# Altium project etna-main.PrjPcb
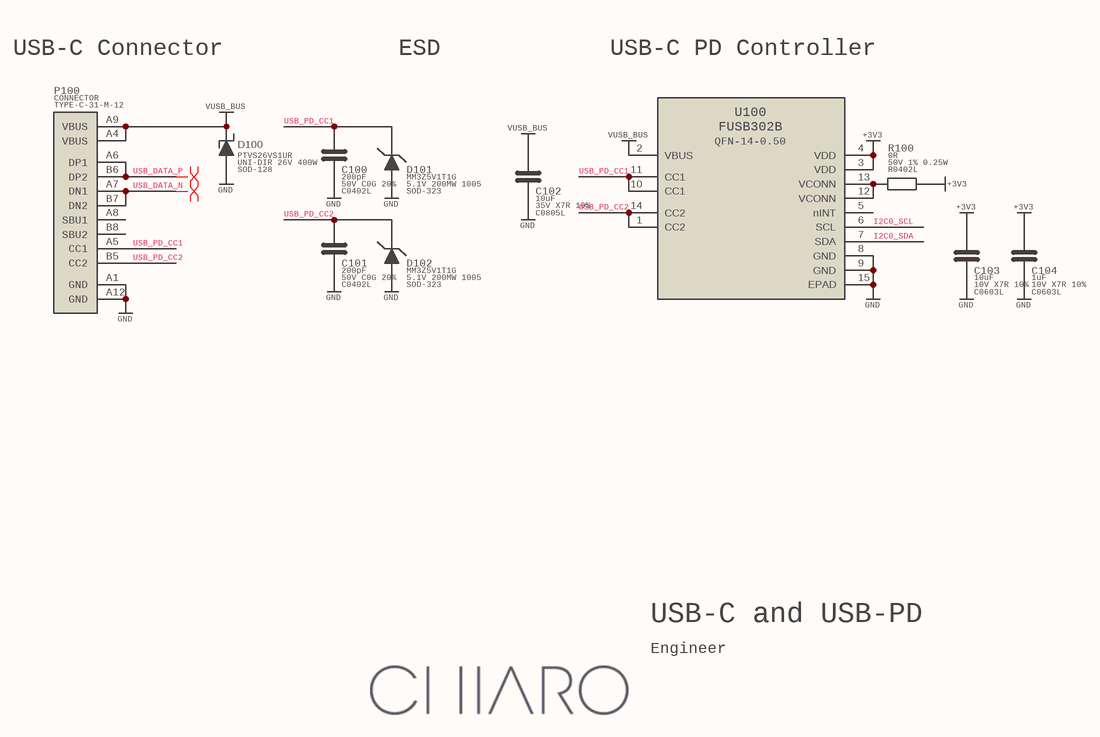
[diagram p0: etna-main-usb.SchDoc]
name: Dominic Moffat; partname: Mainboard; partnumber: 000000; project: ETNA; version: 2.0.0
5 sheets, 104 parts. Net scope: global (net labels, ports and power ports of the same name join across sheets).
Board files: etna-main-panel.PcbDoc, etna-main-pcb.PcbDoc
Sheets:
  etna-main-usb.SchDoc
  etna-main-pmic.SchDoc
  etna-main-mcu.SchDoc
  etna-main-ui.SchDoc
  etna-main-driver.SchDoc

## Sheet etna-main-usb.SchDoc
size A4; DocumentNumber: 1; SheetNumber: 1; SheetTotal: 5; PageSetup: Record=PageOptions|CenterHorizontal=True|CenterVertical=True|PrintScale=0.73|XCorrection=1.00|YCorrection=1.00|PrintKind=1|BorderSize=5000000|LeftOffset=0|BottomOffset=0|Orientation=2|PaperLength=1000|PaperWidth=1000|Scale=100|PaperSource=15|PrintQuality=1200|MediaType=1|DitherType=10|PaperKind=A4|PrintScaleMode=1

### Parts
C100  value 200pF  Specification: 50V C0G 20%  [C0402L]
C101  value 200pF  Specification: 50V C0G 20%  [C0402L]
C102  value 10uF  Specification: 35V X7R 10%  [C0805L]  (hidden comment: 100n)
C103  value 10uF  Specification: 10V X7R 10%  [C0603L]  (hidden comment: 100n)
C104  value 1uF  Specification: 10V X7R 10%  [C0603L]  (hidden comment: 100n)
D100  value PTVS26VS1UR  Specification: UNI-DIR 26V 400W  [SOD-128]  (hidden comment: DIODE_ZEN)
D101  value MM3Z5V1T1G  Specification: 5.1V 200MW 1005  [SOD-323]  (hidden comment: DIODE_TVS)
D102  value MM3Z5V1T1G  Specification: 5.1V 200MW 1005  [SOD-323]  (hidden comment: DIODE_TVS)
P100  value CONNECTOR  [TYPE-C-31-M-12]  (hidden comment: TYPE-C-31-M-12)
R100  value 0R  Specification: 50V 1% 0.25W  [R0402L]
U100  FUSB302B  [QFN-14-0.50]

### Nets
+3V3: C103.1 C104.1 R100.1 U100.3(VDD) U100.4(VDD)
GND: C100.2 C101.2 C102.2 C103.2 C104.2 D100.1(A) D101.1(A) D102.1(A) P100.A1(GND) P100.A12(GND) U100.8(GND) U100.9(GND) U100.15(EPAD)
VUSB_BUS: C102.1 D100.2(K) P100.A4(VBUS) P100.A9(VBUS) U100.2(VBUS)
I2C0_SCL: U100.6(SCL)
I2C0_SDA: U100.7(SDA)
USB_DATA_N: P100.A7(DN1) P100.B7(DN2)
USB_DATA_P: P100.A6(DP1) P100.B6(DP2)
USB_PD_CC1: C100.1 D101.2(K) P100.A5(CC1) U100.10(CC1) U100.11(CC1)
USB_PD_CC2: C101.1 D102.2(K) P100.B5(CC2) U100.1(CC2) U100.14(CC2)
NetR100_2: R100.2 U100.12(VCONN) U100.13(VCONN)

Not connected (* = marked no-connect by the designer): P100 A8(SBU1) B8(SBU2); U100 5(nINT) 44(N.C.)

### Layout directives
differential pair: USB_DATA_N, USB_DATA_P

### Notes on the sheet
- USB-C Connector
- ESD
- USB-C PD Controller
- USB-C and USB-PD
- Engineer

### Library data of the parts
C100-C104 = CAPACITOR_NONPOL
R100 = RESISTOR
U100 = FUSB302B: Value: FUSB302B

## Sheet etna-main-pmic.SchDoc
size A4; DocumentNumber: 1; SheetNumber: 2; SheetTotal: 5; PageSetup: Record=PageOptions|CenterHorizontal=True|CenterVertical=True|PrintScale=0.73|XCorrection=1.00|YCorrection=1.00|PrintKind=1|BorderSize=5000000|LeftOffset=0|BottomOffset=0|Orientation=2|PaperLength=1000|PaperWidth=1000|Scale=100|PaperSource=15|PrintQuality=1200|MediaType=1|DitherType=10|PaperKind=A4|PrintScaleMode=1
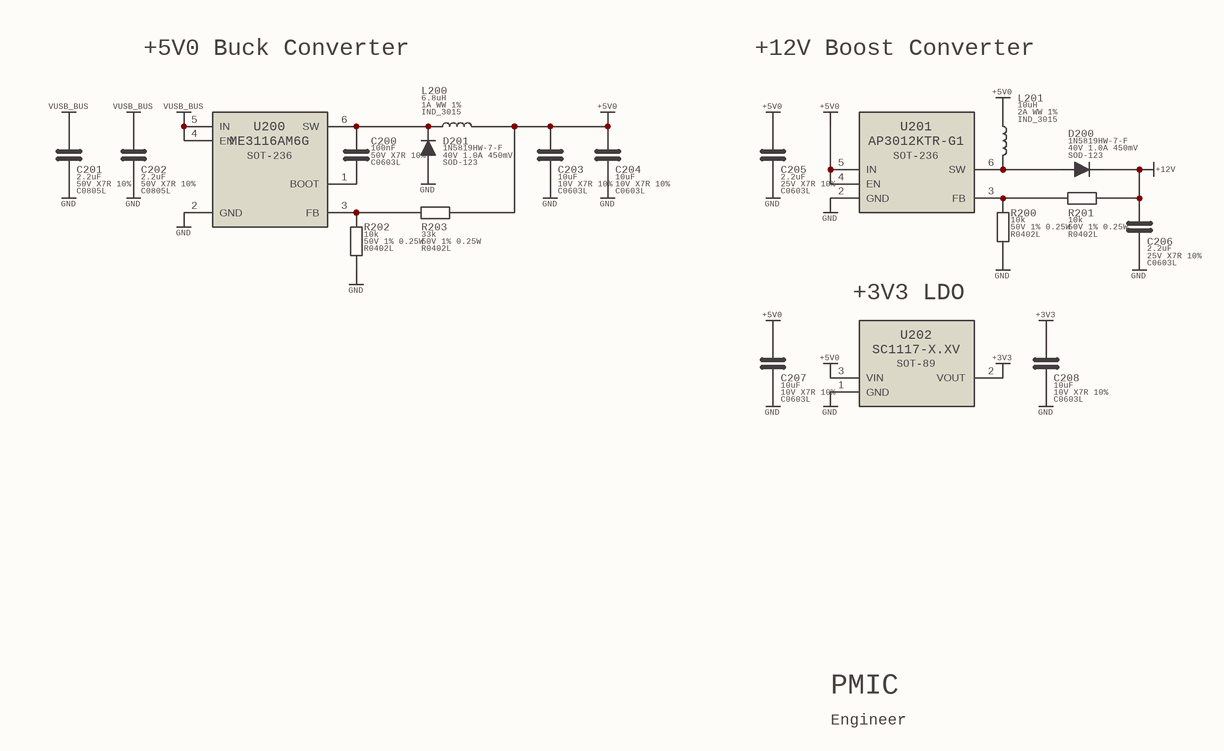
[diagram p1: etna-main-pmic.SchDoc]

### Parts
C200  value 100nF  Specification: 50V X7R 10%  [C0603L]  (hidden comment: 100n)
C201  value 2.2uF  Specification: 50V X7R 10%  [C0805L]  (hidden comment: 100n)
C202  value 2.2uF  Specification: 50V X7R 10%  [C0805L]  (hidden comment: 100n)
C203  value 10uF  Specification: 10V X7R 10%  [C0603L]  (hidden comment: 100n)
C204  value 10uF  Specification: 10V X7R 10%  [C0603L]  (hidden comment: 100n)
C205  value 2.2uF  Specification: 25V X7R 10%  [C0603L]  (hidden comment: 100n)
C206  value 2.2uF  Specification: 25V X7R 10%  [C0603L]  (hidden comment: 100n)
C207  value 10uF  Specification: 10V X7R 10%  [C0603L]  (hidden comment: 100n)
C208  value 10uF  Specification: 10V X7R 10%  [C0603L]  (hidden comment: 100n)
D200  value 1N5819HW-7-F  Specification: 40V 1.0A 450mV  [SOD-123]  (hidden comment: DIODE)
D201  value 1N5819HW-7-F  Specification: 40V 1.0A 450mV  [SOD-123]  (hidden comment: DIODE)
L200  value 6.8uH  Specification: 1A WW 1%  [IND_3015]  (hidden comment: INDUCTOR)
L201  value 10uH  Specification: 2A WW 1%  [IND_3015]  (hidden comment: INDUCTOR)
R200  value 10k  Specification: 50V 1% 0.25W  [R0402L]
R201  value 10k  Specification: 50V 1% 0.25W  [R0402L]
R202  value 10k  Specification: 50V 1% 0.25W  [R0402L]
R203  value 33k  Specification: 50V 1% 0.25W  [R0402L]
U200  ME3116AM6G  [SOT-236]
U201  AP3012KTR-G1  [SOT-236]
U202  SC1117-X.XV  [SOT-89]

### Nets
+3V3: C208.1 U202.2(VOUT)
+5V0: C203.1 C204.1 C205.1 C207.1 L200.2 L201.1 R203.1 U201.4(EN) U201.5(IN) U202.3(VIN)
+12V: C206.1 D200.2(K) R201.2
GND: C201.2 C202.2 C203.2 C204.2 C205.2 C206.2 C207.2 C208.2 D201.1(A) R200.2 R202.2 U200.2(GND) U201.2(GND) U202.1(GND)
VUSB_BUS: C201.1 C202.1 U200.4(EN) U200.5(IN)
NetC200_1: C200.1 D201.2(K) L200.1 U200.6(SW)
NetC200_2: C200.2 U200.1(BOOT)
NetD200_1: D200.1(A) L201.2 U201.6(SW)
NetR200_1: R200.1 R201.1 U201.3(FB)
NetR202_1: R202.1 R203.2 U200.3(FB)

Not connected (* = marked no-connect by the designer): U200 44(N.C.); U201 44(N.C.); U202 44(N.C.)

### Notes on the sheet
- +5V0 Buck Converter
- +12V Boost Converter
- +3V3 LDO
- PMIC
- Engineer

### Library data of the parts
C200-C208 = CAPACITOR_NONPOL
R200-R203 = RESISTOR
U200 = LMR14006: Value: ME3116AM6G
U201 = AP3012KTR-G1: Value: AP3012KTR-G1
U202 = SC1117-X.XV: Value: SC1117-X.XV

## Sheet etna-main-mcu.SchDoc
size A4; DocumentNumber: 1; SheetNumber: 3; SheetTotal: 5; PageSetup: Record=PageOptions|CenterHorizontal=True|CenterVertical=True|PrintScale=0.73|XCorrection=1.00|YCorrection=1.00|PrintKind=1|BorderSize=5000000|LeftOffset=0|BottomOffset=0|Orientation=2|PaperLength=1000|PaperWidth=1000|Scale=100|PaperSource=15|PrintQuality=1200|MediaType=1|DitherType=10|PaperKind=A4|PrintScaleMode=1
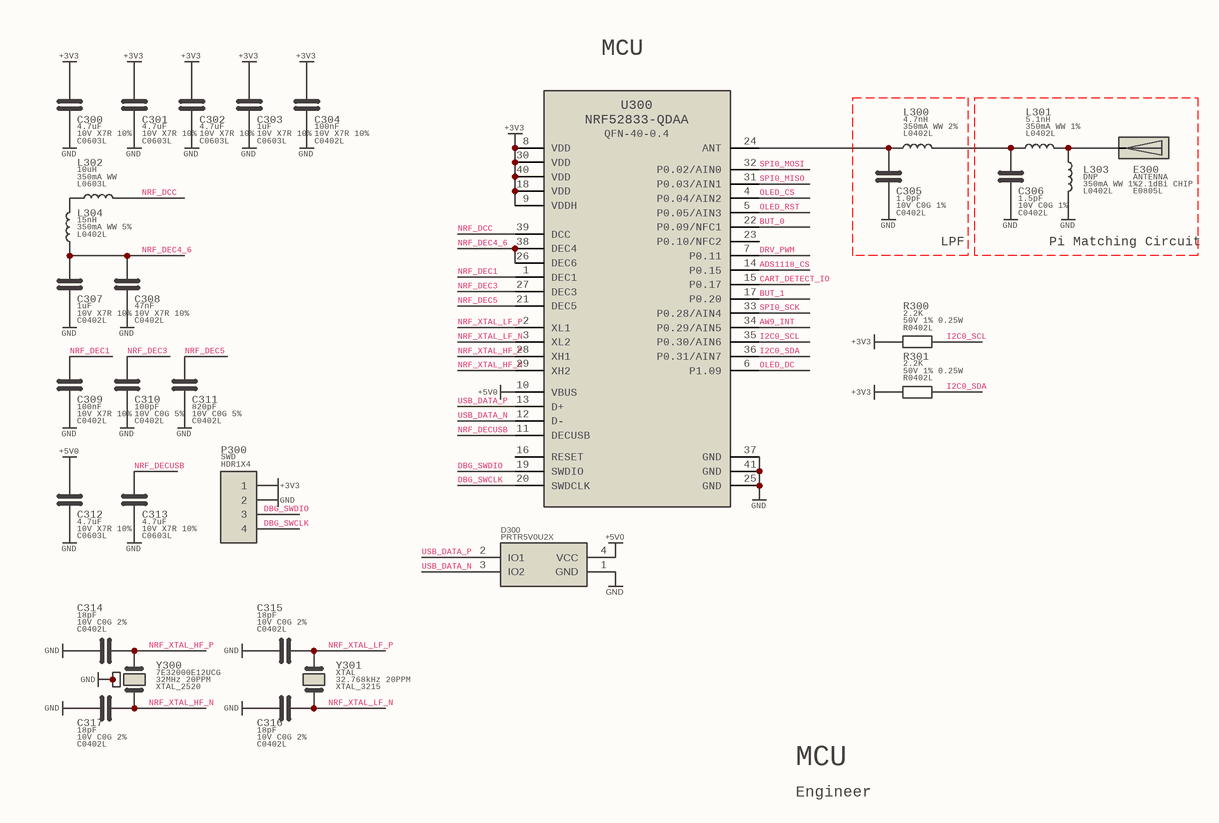
[diagram p2: etna-main-mcu.SchDoc]

### Parts
C300  value 4.7uF  Specification: 10V X7R 10%  [C0603L]
C301  value 4.7uF  Specification: 10V X7R 10%  [C0603L]
C302  value 4.7uF  Specification: 10V X7R 10%  [C0603L]
C303  value 1uF  Specification: 10V X7R 10%  [C0603L]
C304  value 100nF  Specification: 10V X7R 10%  [C0402L]
C305  value 1.0pF  Specification: 10V C0G 1%  [C0402L]
C306  value 1.5pF  Specification: 10V C0G 1%  [C0402L]
C307  value 1uF  Specification: 10V X7R 10%  [C0402L]
C308  value 47nF  Specification: 10V X7R 10%  [C0402L]
C309  value 100nF  Specification: 10V X7R 10%  [C0402L]
C310  value 100pF  Specification: 10V C0G 5%  [C0402L]
C311  value 820pF  Specification: 10V C0G 5%  [C0402L]
C312  value 4.7uF  Specification: 10V X7R 10%  [C0603L]
C313  value 4.7uF  Specification: 10V X7R 10%  [C0603L]
C314  value 18pF  Specification: 10V C0G 2%  [C0402L]
C315  value 18pF  Specification: 10V C0G 2%  [C0402L]
C316  value 18pF  Specification: 10V C0G 2%  [C0402L]
C317  value 18pF  Specification: 10V C0G 2%  [C0402L]
D300  PRTR5V0U2X  [SOT-143B]
E300  Specification: -2.1dBi CHIP  [E0805L]  (hidden comment: ANTENNA)
L300  value 4.7nH  Specification: 350mA WW 2%  [L0402L]  (hidden comment: INDUCTOR)
L301  value 5.1nH  Specification: 350mA WW 1%  [L0402L]  (hidden comment: INDUCTOR)
L302  value 10uH  Specification: 350mA WW  [L0603L]  (hidden comment: INDUCTOR)
L303  value DNP  Specification: 350mA WW 1%  [L0402L]  (hidden comment: INDUCTOR)
L304  value 15nH  Specification: 350mA WW 5%  [L0402L]  (hidden comment: INDUCTOR)
P300  value SWD  [HDR1X4]  (hidden comment: H4)
R300  value 2.2K  Specification: 50V 1% 0.25W  [R0402L]
R301  value 2.2K  Specification: 50V 1% 0.25W  [R0402L]
U300  NRF52833-QDAA  [QFN-40-0.4]
Y300  value 7E32000E12UCG  Specification: 32MHz 20PPM  [XTAL_2520]  (hidden comment: XTAL_4P)
Y301  value XTAL  Specification: 32.768kHz 20PPM  [XTAL_3215]  (hidden comment: XTAL_2P)

### Nets
+3V3: C300.1 C301.1 C302.1 C303.1 C304.1 P300.1 R300.1 R301.1 U300.8(VDD) U300.9(VDDH) U300.18(VDD) U300.30(VDD) U300.40(VDD)
+5V0: C312.1 D300.4(VCC) U300.10(VBUS)
GND: C300.2 C301.2 C302.2 C303.2 C304.2 C305.2 C306.2 C307.2 C308.2 C309.2 C310.2 C311.2 C312.2 C313.2 C314.1 C315.1 C316.1 C317.1 D300.1(GND) L303.2 P300.2 U300.25(GND) U300.37(GND) U300.41(GND) Y300.2(GND) Y300.4(GND)
ADS1118_CS: U300.14(P0.15)
AW9_INT: U300.34(P0.29/AIN5)
BUT_0: U300.22(P0.09/NFC1)
BUT_1: U300.17(P0.20)
CART_DETECT_IO: U300.15(P0.17)
DBG_SWCLK: P300.4 U300.20(SWDCLK)
DBG_SWDIO: P300.3 U300.19(SWDIO)
DRV_PWM: U300.7(P0.11)
I2C0_SCL: R300.2 U300.35(P0.30/AIN6)
I2C0_SDA: R301.2 U300.36(P0.31/AIN7)
NRF_DCC: L302.2 U300.39(DCC)
NRF_DEC1: C309.1 U300.1(DEC1)
NRF_DEC3: C310.1 U300.27(DEC3)
NRF_DEC4_6: C307.1 C308.1 L304.1 U300.26(DEC6) U300.38(DEC4)
NRF_DEC5: C311.1 U300.21(DEC5)
NRF_DECUSB: C313.1 U300.11(DECUSB)
NRF_XTAL_HF_N: C317.2 U300.29(XH2) Y300.3(OSC2)
NRF_XTAL_HF_P: C314.2 U300.28(XH1) Y300.1(OSC1)
NRF_XTAL_LF_N: C316.2 U300.3(XL2) Y301.2(OSC2)
NRF_XTAL_LF_P: C315.2 U300.2(XL1) Y301.1(OSC1)
OLED_CS: U300.4(P0.04/AIN2)
OLED_DC: U300.6(P1.09)
OLED_RST: U300.5(P0.05/AIN3)
SPI0_MISO: U300.31(P0.03/AIN1)
SPI0_MOSI: U300.32(P0.02/AIN0)
SPI0_SCK: U300.33(P0.28/AIN4)
USB_DATA_N: D300.3(IO2) U300.12(D-)
USB_DATA_P: D300.2(IO1) U300.13(D+)
NetC305_1: C305.1 L300.1 U300.24(ANT)
NetC306_1: C306.1 L300.2 L301.1
NetE300_1: E300.1(IN) L301.2 L303.1
NetL302_1: L302.1 L304.2

Not connected (* = marked no-connect by the designer): U300 16(RESET) 23(P0.10/NFC2) 44(N.C.)

### Notes on the sheet
- MCU
- LPF
- (near L303) Pi Matching Circuit
- Engineer

### Library data of the parts
C300-C317 = CAPACITOR_NONPOL
D300 = PRTR5V0U2X: Ultra low capacitance double rail-to-rail ESD protection diode
R300 R301 = RESISTOR
U300 = NRF52833-QDAA: RF System on a Chip - SoC nRF52833-QIAA QFN 40L 5x5; Value: NRF52833-QDAA
E300 = ANTENNA: Value: ANTENNA

## Sheet etna-main-ui.SchDoc
size A4; DocumentNumber: 1; SheetNumber: 4; SheetTotal: 5; PageSetup: Record=PageOptions|CenterHorizontal=True|CenterVertical=True|PrintScale=0.73|XCorrection=1.00|YCorrection=1.00|PrintKind=1|BorderSize=5000000|LeftOffset=0|BottomOffset=0|Orientation=2|PaperLength=1000|PaperWidth=1000|Scale=100|PaperSource=15|PrintQuality=1200|MediaType=1|DitherType=10|PaperKind=A4|PrintScaleMode=1
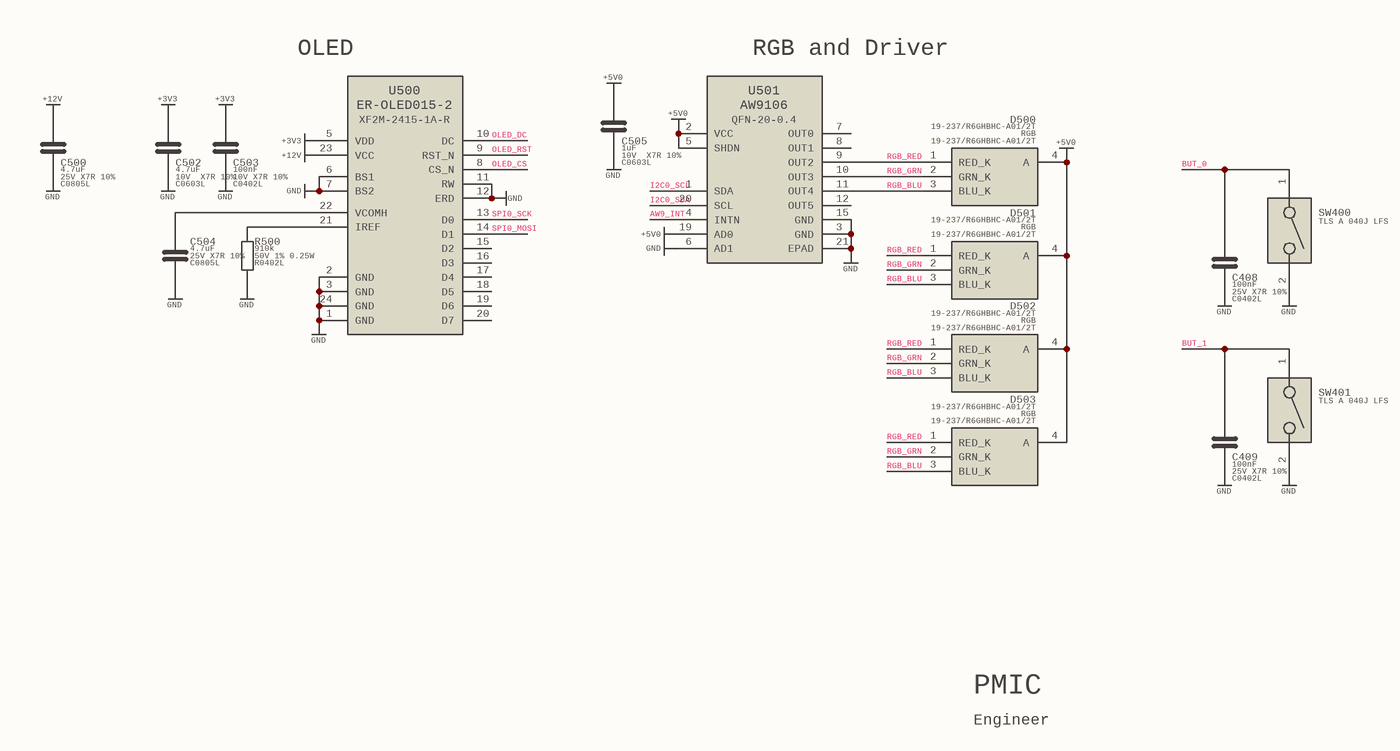
[diagram p3: etna-main-ui.SchDoc]

### Parts
C408  value 100nF  Specification: 25V X7R 10%  [C0402L]
C409  value 100nF  Specification: 25V X7R 10%  [C0402L]
C500  value 4.7uF  Specification: 25V X7R 10%  [C0805L]
C502  value 4.7uF  Specification: 10V  X7R 10%  [C0603L]
C503  value 100nF  Specification: 10V X7R 10%  [C0402L]
C504  value 4.7uF  Specification: 25V X7R 10%  [C0805L]
C505  value 1uF  Specification: 10V  X7R 10%  [C0603L]
D500  Specification: RGB  [19-237/R6GHBHC-A01/2T]  (hidden comment: 19-237/R6GHBHC-A01/2T)
D501  Specification: RGB  [19-237/R6GHBHC-A01/2T]  (hidden comment: 19-237/R6GHBHC-A01/2T)
D502  Specification: RGB  [19-237/R6GHBHC-A01/2T]  (hidden comment: 19-237/R6GHBHC-A01/2T)
D503  Specification: RGB  [19-237/R6GHBHC-A01/2T]  (hidden comment: 19-237/R6GHBHC-A01/2T)
R500  value 910k  Specification: 50V 1% 0.25W  [R0402L]
SW400  TLS A 040J LFS  [TLS A 040J LFS]
SW401  TLS A 040J LFS  [TLS A 040J LFS]
U500  ER-OLED015-2  [XF2M-2415-1A-R]
U501  value AW9106  [QFN-20-0.4]  (hidden comment: AW9109)

### Nets
+3V3: C502.1 C503.1 U500.5(VDD)
+5V0: C505.1 D500.4(A) D501.4(A) D502.4(A) D503.4(A) U501.2(VCC) U501.5(SHDN) U501.19(AD0)
+12V: C500.1 U500.23(VCC)
GND: C408.2 C409.2 C500.2 C502.2 C503.2 C504.2 C505.2 R500.2 SW400.2 SW401.2 U500.1(GND) U500.2(GND) U500.3(GND) U500.6(BS1) U500.7(BS2) U500.11(RW) U500.12(ERD) U500.24(GND) U501.3(GND) U501.6(AD1) U501.15(GND) U501.21(EPAD)
AW9_INT: U501.4(INTN)
BUT_0: C408.1 SW400.1
BUT_1: C409.1 SW401.1
I2C0_SCL: U501.1(SDA)
I2C0_SDA: U501.20(SCL)
OLED_CS: U500.8(CS_N)
OLED_DC: U500.10(DC)
OLED_RST: U500.9(RST_N)
RGB_BLU: D500.3(BLU_K) D501.3(BLU_K) D502.3(BLU_K) D503.3(BLU_K) U501.11(OUT4)
RGB_GRN: D500.2(GRN_K) D501.2(GRN_K) D502.2(GRN_K) D503.2(GRN_K) U501.10(OUT3)
RGB_RED: D500.1(RED_K) D501.1(RED_K) D502.1(RED_K) D503.1(RED_K) U501.9(OUT2)
SPI0_MOSI: U500.14(D1)
SPI0_SCK: U500.13(D0)
NetC504_1: C504.1 U500.22(VCOMH)
NetR500_1: R500.1 U500.21(IREF)

Not connected (* = marked no-connect by the designer): U500 15(D2) 16(D3) 17(D4) 18(D5) 19(D6) 20(D7) 44(N.C.); U501 7(OUT0) 8(OUT1) 12(OUT5) 44(N.C.)

### Notes on the sheet
- OLED
- RGB and Driver
- PMIC
- Engineer

### Library data of the parts
C408 C409 C500 C502-C505 = CAPACITOR_NONPOL
R500 = RESISTOR
SW400 SW401 = SWITCH
U501 = AW9106
D500-D503 = 19-237/R6GHBHC-A01/2T: Value: 19-237/R6GHBHC-A01/2T
U500 = ER-OLED015-2: Value: ER-OLED015-2

## Sheet etna-main-driver.SchDoc
size A4; DocumentNumber: 1; SheetNumber: 5; SheetTotal: 5; PageSetup: Record=PageOptions|CenterHorizontal=True|CenterVertical=True|PrintScale=0.73|XCorrection=1.00|YCorrection=1.00|PrintKind=1|BorderSize=5000000|LeftOffset=0|BottomOffset=0|Orientation=2|PaperLength=1000|PaperWidth=1000|Scale=100|PaperSource=15|PrintQuality=1200|MediaType=1|DitherType=10|PaperKind=A4|PrintScaleMode=1
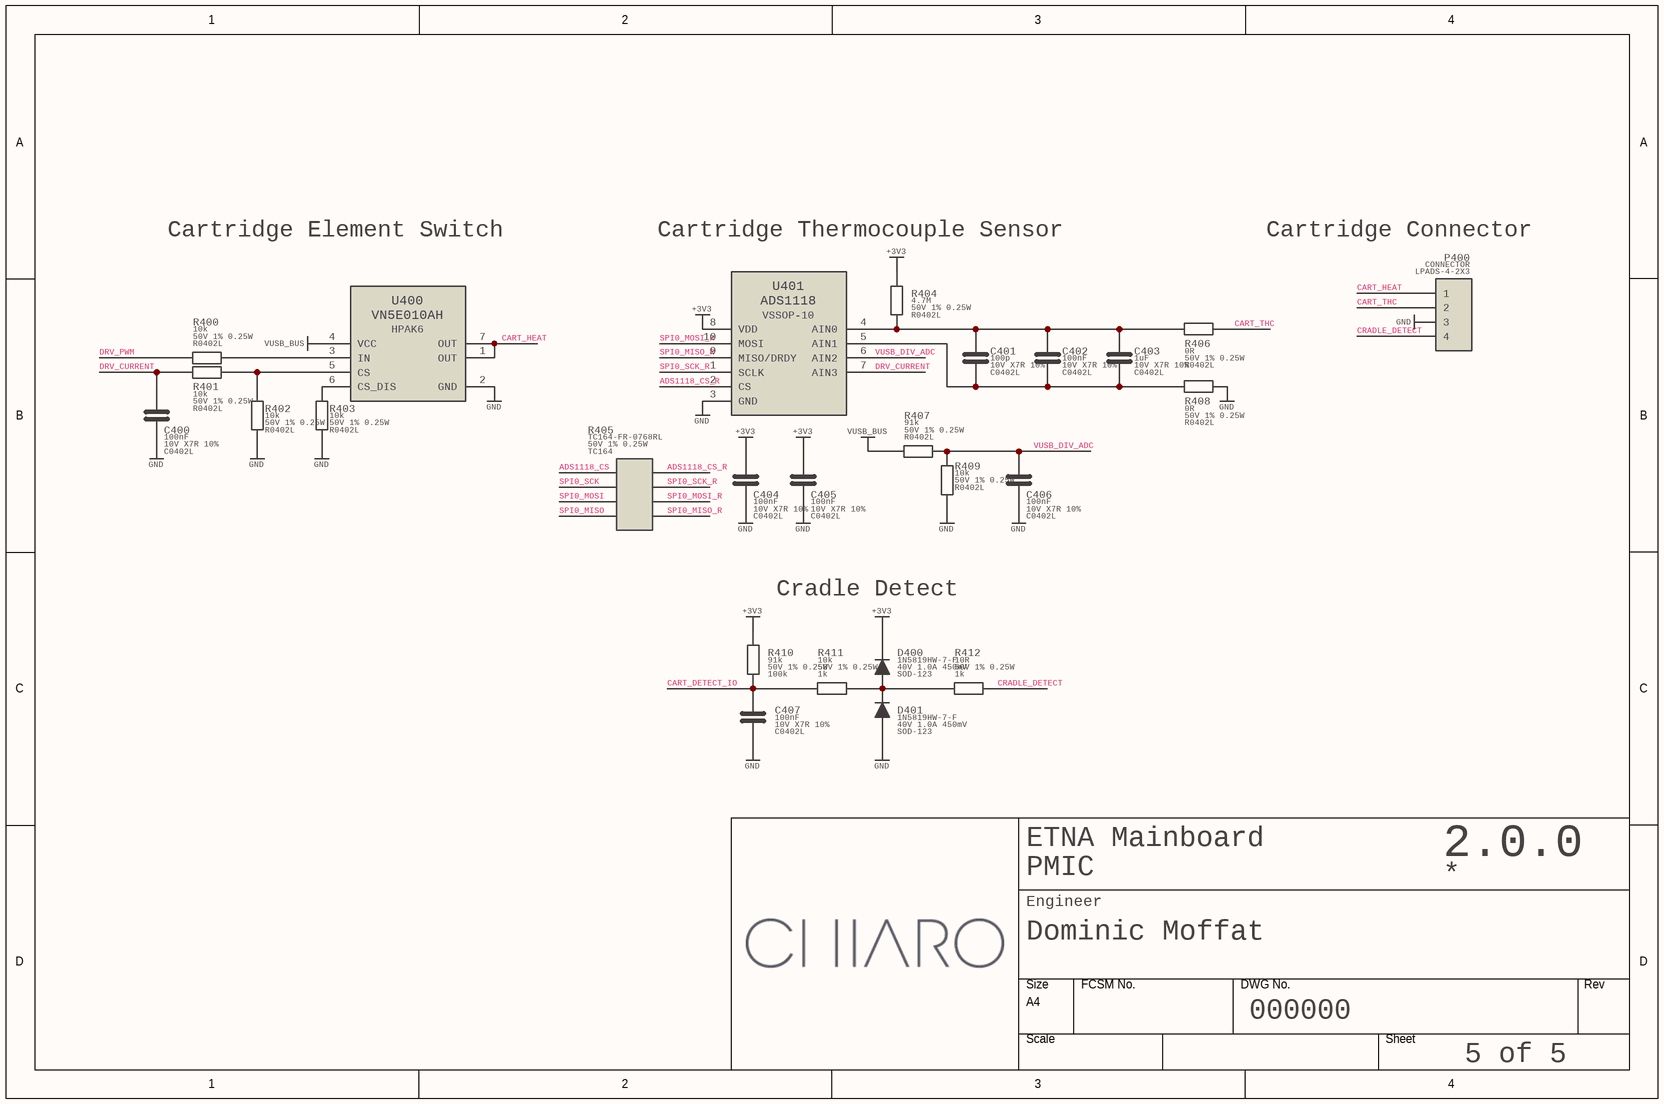
[diagram p4: etna-main-driver.SchDoc]

### Parts
C400  value 100nF  Specification: 10V X7R 10%  [C0402L]
C401  value 100p  Specification: 10V X7R 10%  [C0402L]
C402  value 100nF  Specification: 10V X7R 10%  [C0402L]
C403  value 1uF  Specification: 10V X7R 10%  [C0402L]
C404  value 100nF  Specification: 10V X7R 10%  [C0402L]
C405  value 100nF  Specification: 10V X7R 10%  [C0402L]
C406  value 100nF  Specification: 10V X7R 10%  [C0402L]
C407  value 100nF  Specification: 10V X7R 10%  [C0402L]
D400  value 1N5819HW-7-F  Specification: 40V 1.0A 450mV  [SOD-123]  (hidden comment: DIODE)
D401  value 1N5819HW-7-F  Specification: 40V 1.0A 450mV  [SOD-123]  (hidden comment: DIODE)
P400  value CONNECTOR  [LPADS-4-2X3]  (hidden comment: H4)
R400  value 10k  Specification: 50V 1% 0.25W  [R0402L]  (hidden comment: RESISTOR)
R401  value 10k  Specification: 50V 1% 0.25W  [R0402L]  (hidden comment: RESISTOR)
R402  value 10k  Specification: 50V 1% 0.25W  [R0402L]  (hidden comment: RESISTOR)
R403  value 10k  Specification: 50V 1% 0.25W  [R0402L]  (hidden comment: RESISTOR)
R404  value 4.7M  Specification: 50V 1% 0.25W  [R0402L]  (hidden comment: RESISTOR)
R405  value TC164-FR-0768RL  Specification: 50V 1% 0.25W  [TC164]  (hidden comment: RESISTOR_4)
R406  value 0R  Specification: 50V 1% 0.25W  [R0402L]  (hidden comment: RESISTOR)
R407  value 91k  Specification: 50V 1% 0.25W  [R0402L]  (hidden comment: RESISTOR)
R408  value 0R  Specification: 50V 1% 0.25W  [R0402L]  (hidden comment: RESISTOR)
R409  value 10k  Specification: 50V 1% 0.25W  [R0402L]  (hidden comment: RESISTOR)
R410  value 91k  Footprint: 100k  Specification: 50V 1% 0.25W  [R0402L]  (hidden comment: RESISTOR)
R411  value 10k  Footprint: 1k  Specification: 50V 1% 0.25W  [R0402L]  (hidden comment: RESISTOR)
R412  value 10R  Footprint: 1k  Specification: 50V 1% 0.25W  [R0402L]  (hidden comment: RESISTOR)
U400  VN5E010AH  [HPAK6]
U401  ADS1118  [VSSOP-10]

### Nets
+3V3: C404.1 C405.1 D400.2(K) R404.2 R410.1 U401.8(VDD)
GND: C400.2 C404.2 C405.2 C406.2 C407.2 D401.1(A) P400.3 R402.1 R403.1 R408.1 R409.1 U400.2(GND) U401.3(GND)
VUSB_BUS: R407.1 U400.4(VCC)
ADS1118_CS: R405.1
ADS1118_CS_R: R405.8 U401.2(CS)
CART_DETECT_IO: C407.1 R410.2 R411.2
CART_HEAT: P400.1 U400.1(OUT) U400.7(OUT)
CART_THC: P400.2 R406.1
CRADLE_DETECT: P400.4 R412.1
DRV_CURRENT: C400.1 R401.2 U401.7(AIN3)
DRV_PWM: R400.2
SPI0_MISO: R405.4
SPI0_MISO_R: R405.5 U401.9(MISO/DRDY)
SPI0_MOSI: R405.3
SPI0_MOSI_R: R405.6 U401.10(MOSI)
SPI0_SCK: R405.2
SPI0_SCK_R: R405.7 U401.1(SCLK)
VUSB_DIV_ADC: C406.1 R407.2 R409.2 U401.6(AIN2)
NetC401_1: C401.1 C402.1 C403.1 R404.1 R406.2 U401.4(AIN0)
NetC401_2: C401.2 C402.2 C403.2 R408.2 U401.5(AIN1)
NetD400_1: D400.1(A) D401.2(K) R411.1 R412.2
NetR400_1: R400.1 U400.3(IN)
NetR401_1: R401.1 R402.2 U400.5(CS)
NetR403_2: R403.2 U400.6(CS_DIS)

Not connected (* = marked no-connect by the designer): U400 44(N.C.); U401 44(N.C.)

### Notes on the sheet
- Cartridge Element Switch
- (near R404) Cartridge Thermocouple Sensor
- (near P400) Cartridge Connector
- Cradle Detect
- PMIC
- Engineer

### Library data of the parts
C400-C407 = CAPACITOR_NONPOL
U400 = VN5E010AH: Value: VN5E010AH
U401 = ADS1118: Value: ADS1118

## Nets that join several sheets
+3V3: etna-main-usb (5 pins), etna-main-pmic (C208.1 U202.2), etna-main-mcu (13 pins), etna-main-ui (C502.1 C503.1 U500.5), etna-main-driver (6 pins)
+5V0: etna-main-pmic (10 pins), etna-main-mcu (C312.1 D300.4 U300.10), etna-main-ui (8 pins)
+12V: etna-main-pmic (C206.1 D200.2 R201.2), etna-main-ui (C500.1 U500.23)
GND: etna-main-usb (13 pins), etna-main-pmic (14 pins), etna-main-mcu (26 pins), etna-main-ui (22 pins), etna-main-driver (13 pins)
VUSB_BUS: etna-main-usb (5 pins), etna-main-pmic (C201.1 C202.1 U200.4 U200.5), etna-main-driver (R407.1 U400.4)
ADS1118_CS: etna-main-mcu (U300.14), etna-main-driver (R405.1)
AW9_INT: etna-main-mcu (U300.34), etna-main-ui (U501.4)
BUT_0: etna-main-mcu (U300.22), etna-main-ui (C408.1 SW400.1)
BUT_1: etna-main-mcu (U300.17), etna-main-ui (C409.1 SW401.1)
CART_DETECT_IO: etna-main-mcu (U300.15), etna-main-driver (C407.1 R410.2 R411.2)
DRV_PWM: etna-main-mcu (U300.7), etna-main-driver (R400.2)
I2C0_SCL: etna-main-usb (U100.6), etna-main-mcu (R300.2 U300.35), etna-main-ui (U501.1)
I2C0_SDA: etna-main-usb (U100.7), etna-main-mcu (R301.2 U300.36), etna-main-ui (U501.20)
OLED_CS: etna-main-mcu (U300.4), etna-main-ui (U500.8)
OLED_DC: etna-main-mcu (U300.6), etna-main-ui (U500.10)
OLED_RST: etna-main-mcu (U300.5), etna-main-ui (U500.9)
SPI0_MISO: etna-main-mcu (U300.31), etna-main-driver (R405.4)
SPI0_MOSI: etna-main-mcu (U300.32), etna-main-ui (U500.14), etna-main-driver (R405.3)
SPI0_SCK: etna-main-mcu (U300.33), etna-main-ui (U500.13), etna-main-driver (R405.2)
USB_DATA_N: etna-main-usb (P100.A7 P100.B7), etna-main-mcu (D300.3 U300.12)
USB_DATA_P: etna-main-usb (P100.A6 P100.B6), etna-main-mcu (D300.2 U300.13)